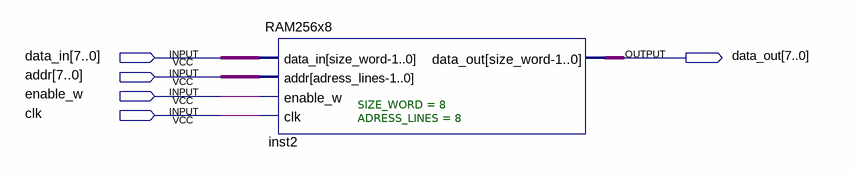
[diagram p0: schematic sheet]
// Quartus schematic test_ram.bdf as structural Verilog: 1 symbols, 5 pins
module test_ram (
  input  [7:0] data_in,
  input  [7:0] addr,
  input  enable_w,
  input  clk,
  output [7:0] data_out
);

  RAM256x8 #(.SIZE_WORD(8), .ADRESS_LINES(8)) inst2 (
    .data_in(data_in), .addr(addr), .enable_w(enable_w), .clk(clk), .data_out(data_out));
endmodule
